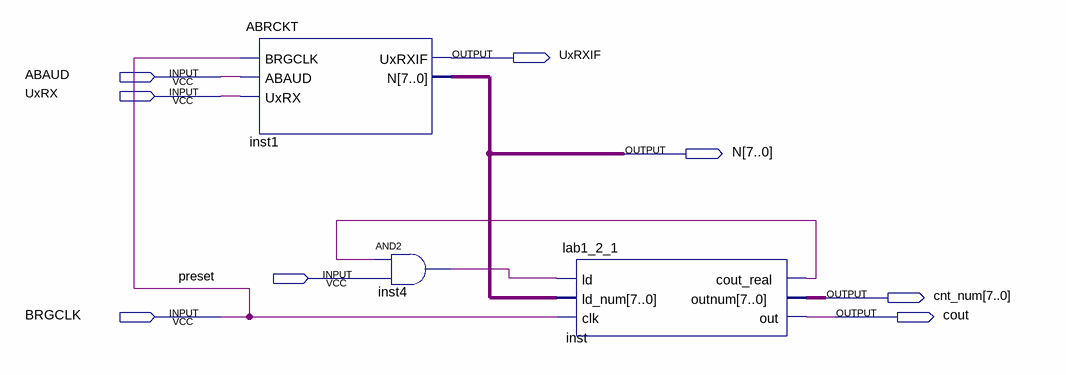
[diagram p0: schematic sheet]
// Quartus schematic BRGCKT.bdf as structural Verilog: 3 symbols, 8 pins
module BRGCKT (
  input  ABAUD,
  input  UxRX,
  input  preset,
  input  BRGCLK,
  output UxRXIF,
  output [7:0] N,
  output [7:0] cnt_num,
  output cout
);

  wire inst4_out, inst_cout_real;

  ABRCKT inst1 (.BRGCLK(BRGCLK), .ABAUD(ABAUD), .UxRX(UxRX), .UxRXIF(UxRXIF), .N(N));
  and inst4 (inst4_out, inst_cout_real, preset);
  lab1_2_1 inst (.ld(inst4_out), .ld_num(N), .clk(BRGCLK), .cout_real(inst_cout_real), .outnum(cnt_num), .out(cout));
endmodule
